# EAGLE design Power Supply 5 (EAGLE 5.11)
BOM: EXCLUDE; PARTNO: NCP1117ST50T3G
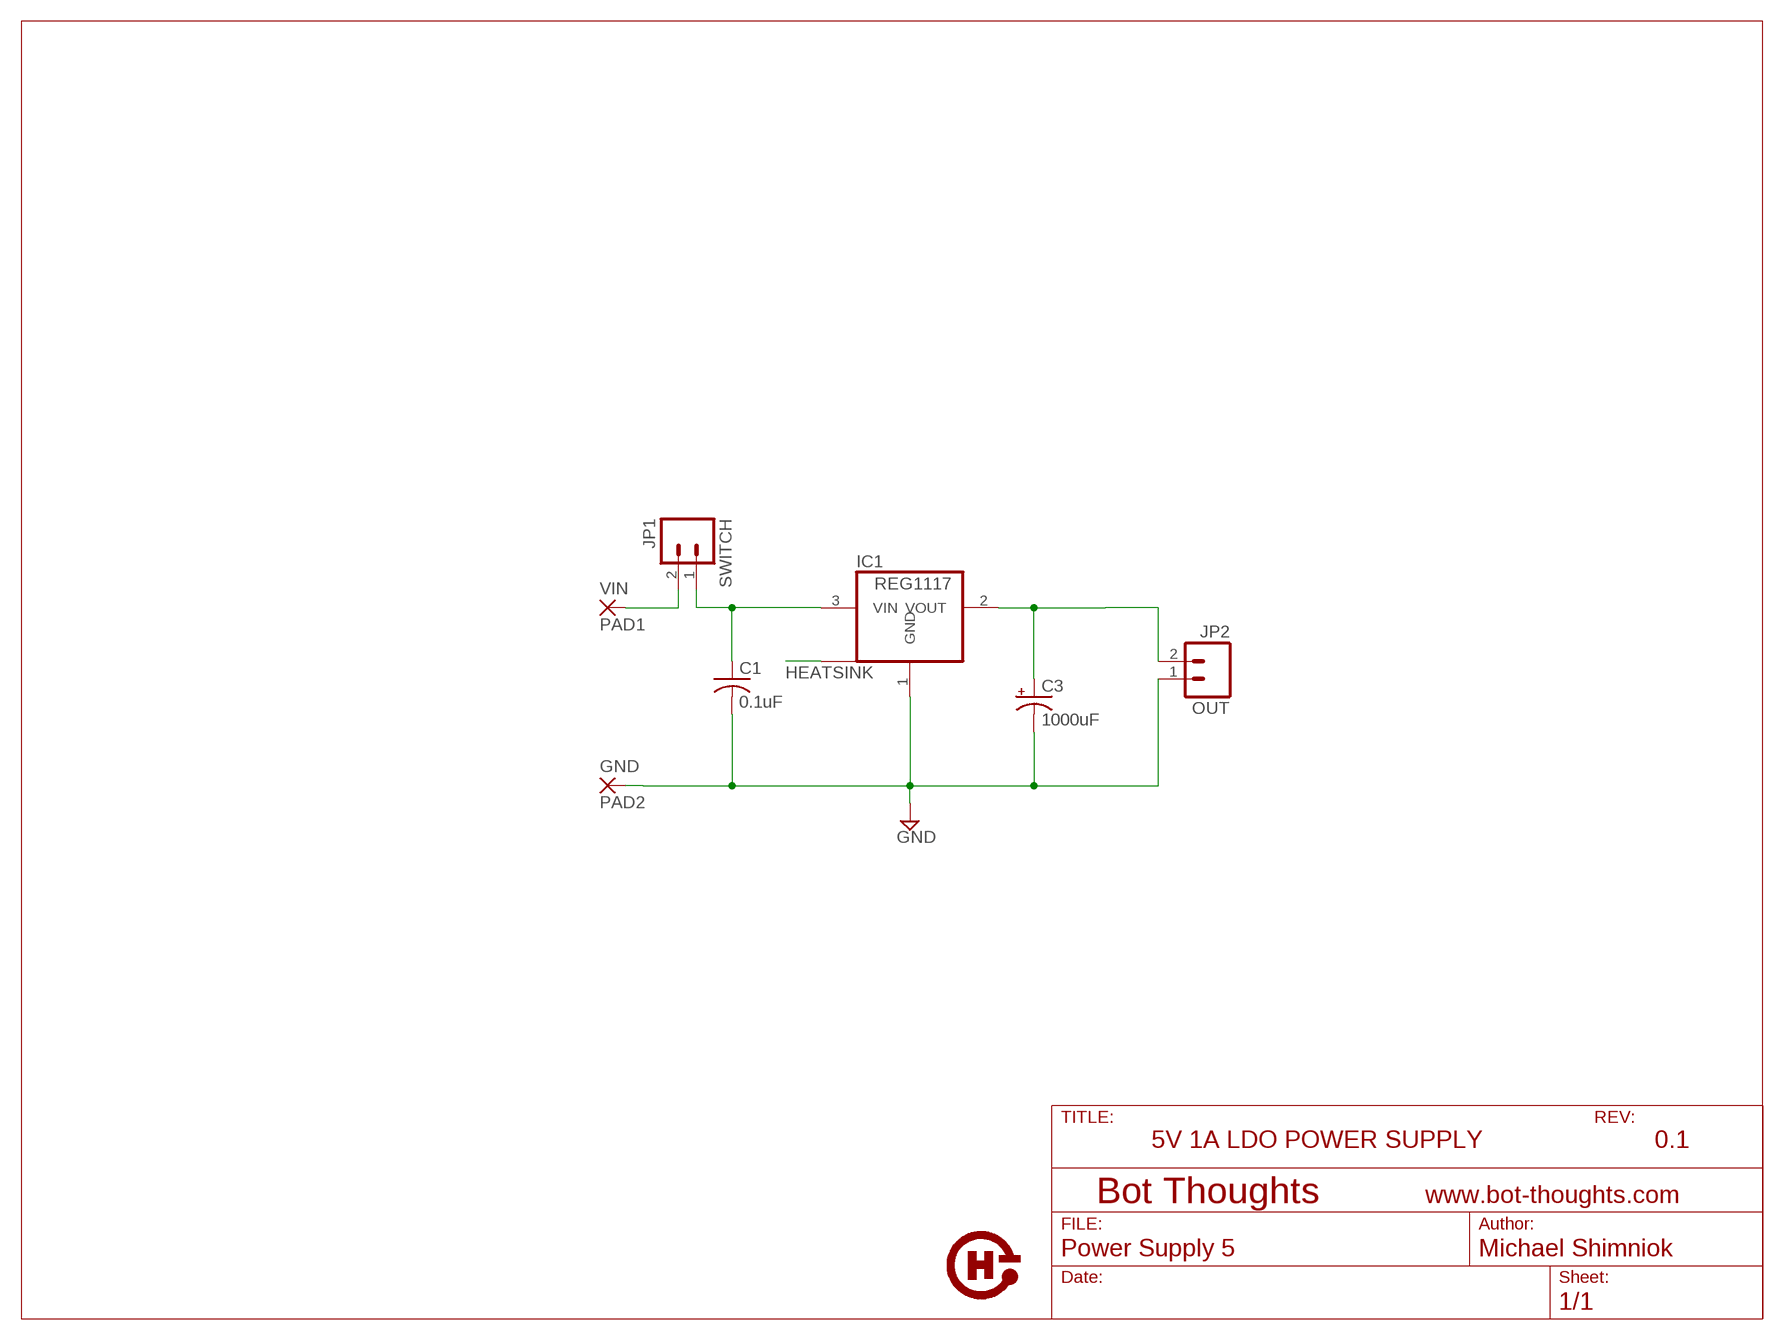
[diagram p0: schematic, sheet 1]

## Parts
C1  0.1uF  C-USC0805  [C0805]
C3  1000uF  CPOL-USE3.5-8  [E3,5-8]
GND  PAD2  3,17/1,3  [3,17/1,3]
IC1  REG1117  [SOT223]
JP1  SWITCH  M02PTH  [1X02]
JP2  OUT  M02PTH  [1X02]
U$1  OSHW-LOGO  [OSHW-LOGO]
VIN  PAD1  3,17/1,3  [3,17/1,3]

## Nets
GND: C1.2 C3.- GND.1(P) IC1.1(GND) JP2.1
HEATSINK: IC1.4(THERM)
N$1: JP1.2 VIN.1(P)
VIN: C1.1 IC1.3(VIN) JP1.1
VOUT: C3.+ IC1.2(VOUT) JP2.2

## Notes on the sheet
- 5V 1A LDO POWER SUPPLY | 0.1

## Library data of the parts
C1 = rcl:C-US: CAPACITOR, American symbol
C3 = rcl:CPOL-US: POLARIZED CAPACITOR, American symbol
GND VIN = wirepad:3,17/1,3: THROUGH-HOLE PAD
IC1 = burr-brown:REG1117: 800mA and 1A Low Dropout (LDO) Positive Regulator 1.8V, 2.5V, 2.85V, 3.3V, 5V, and Adj
JP1 JP2 = SparkFun:M02: Header 2 Standard 2-pin 0.1" header. Use with straight break away headers (SKU : PRT-00116), right angle break away headers (PRT-00553), swiss pins (PRT-00743), machine pins (PRT-00117), and female headers (PRT-00115). Molex polarized connector foot print use with SKU : PRT-08233 with associated crimp pins and housings.
U$1 = SparkFun:OSHW-LOGO: Open Source Hardware Logo This logo indicates the piece of hardware it is found on incorporates a OSHW license and/or adheres to the definition of open source hardware found here: http://freedomdefined.org/OSHW

## Board
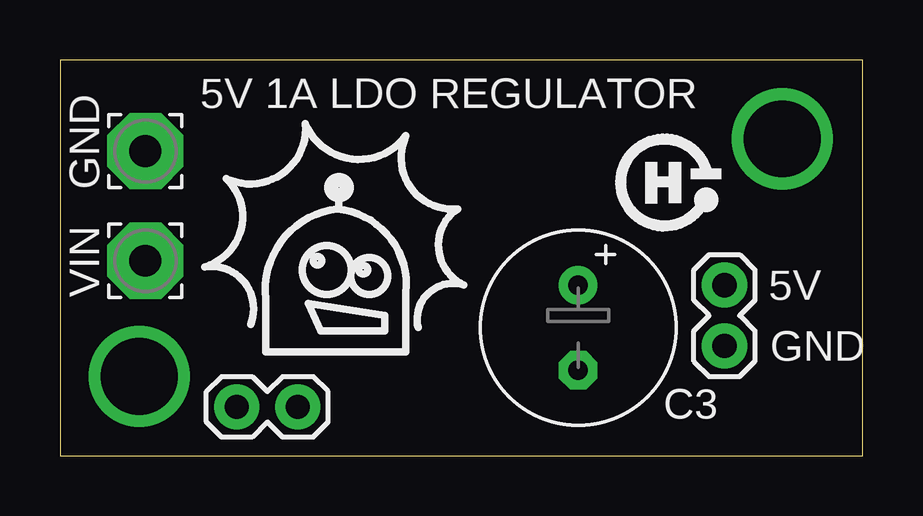
[diagram p1: board, top side]
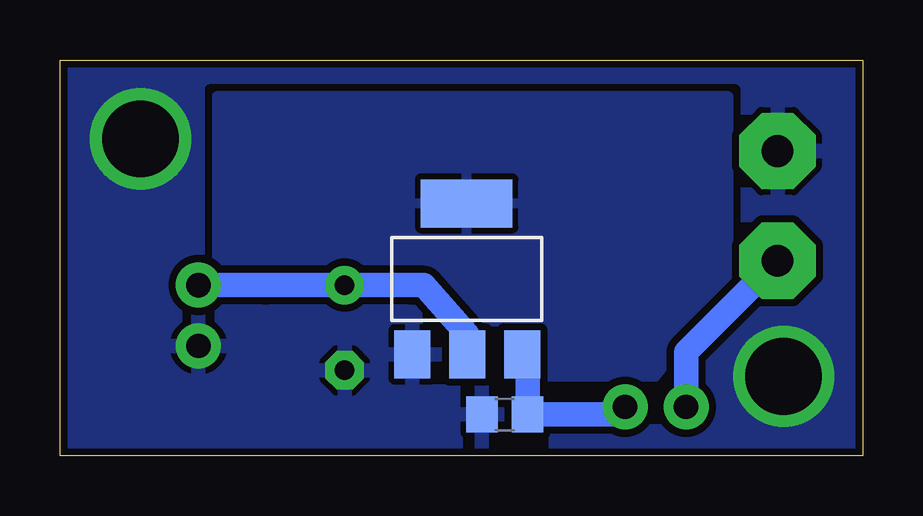
[diagram p2: board, bottom side, seen from below]

Size 33.45 x 16.5 mm. Coordinates in mm from the lower left corner, seen from the top.
Outline: 0,0 33.45,0 33.45,16.5 0,16.5 0,0
Copper layers (1*16): Top 0.035mm / dielectric 1.5mm / Bottom 0.035mm
Design rules "SparkFun": minimum track width 8mil, minimum drill 20mil, track to track 8mil, track to pad 8mil, pad to pad 8mil, via to via 8mil, smd to smd 8mil, copper to edge 10mil, drill to drill 8mil, minimum pad ring 12mil, minimum via ring 10mil, stop-mask expansion 4mil, vias tented up to drill 25mil, thermal gap 10mil

### Footprints (pad centres in the part's own frame; a part is rotated, then mirrored left to right if it is on the bottom)
C0805 = smd 1.3 x 1.5: 1 -0.95,0; 2 0.95,0
E3,5-8 = drill 0.813 pad 1.6 round: + -1.778,0 | drill 0.813 pad 1.6 octagon: - 1.778,0
3,17/1,3 = drill 1.321 pad 3.175 octagon: 1 0,0
SOT223 = smd 1.499 x 2.007: 1 -2.261,-3.15; 2 0.025,-3.15; 3 2.311,-3.15 | smd 3.81 x 2.007: 4 0,3.15
1X02 = drill 1.016 pad 1.88 round: 1 0,0; 2 2.54,0

### Placement (x,y rotation side)
C1  14.92,1.71 180 bottom
C3  21.59,5.33 270 top
GND  3.56,12.7 0 top
IC1  16.51,7.37 0 bottom
JP1  9.91,2.03 180 top
JP2  27.69,4.57 90 top
U$1  25.15,11.43 0 top
U$2  BOT-THOUGHTS  [BOT-THOUGHTS]  11.87,6.6 0 top
VIN  3.56,8.13 0 top

### Tracks (layer width: path | path; a pad name or v marks a point on that pad's centre or on a via)
GND  (via drill 3.2)
  other vias: 3.3,3.3 30.1,13.21
  pour Bottom (isolate 0.305, rank 2): 0,16.51 33.4,16.51 33.4,0 0,0
HEATSINK
  pour Bottom (isolate 0.305): 8.64,3.3 5.59,7.11 5.59,14.99 26.92,14.99 26.92,7.11 18.29,7.11 16.51,3.3
N$1
  Bottom 1.016: JP1.2 7.37,4.32 VIN.1
VIN
  Bottom 1.016: JP1.1 10.22,1.71 C1.1 13.97,3.99 IC1.3
VOUT
  Bottom 1.016: IC1.2 16.48,5.05 18.29,7.11 18.8,7.11 C3.+ 24.89,7.11 JP2.2

### Text on the board
tNames: 5V 1A LDO REGULATOR | GND | VIN | 5V | GND